# Altium schematic sheet CAN.SchDoc: Title
size A4; Date: *******; ApprovedBy: *******; CheckedBy: None; Author: *******; CompanyName: *******; DrawnBy: Jacob Chisholm; Engineer: *******; Organization: *******; Address1: *******; Address2: *******; Address3: *******; Address4: *******; DocumentNumber: 7; Revision: *******; SheetNumber: 7; SheetTotal: 9; Address_Website: https://jchisholm204.github.io; E-Mail: JacobChisholm1010@gmail.com; CurrentTime: *******; CurrentDate: *******; Time: *******; DocumentFullPathAndName: *******; DocumentName: *******; ModifiedDate: *******; ImagePath: *******; ProjectName: *******; Application_BuildNumber: *******
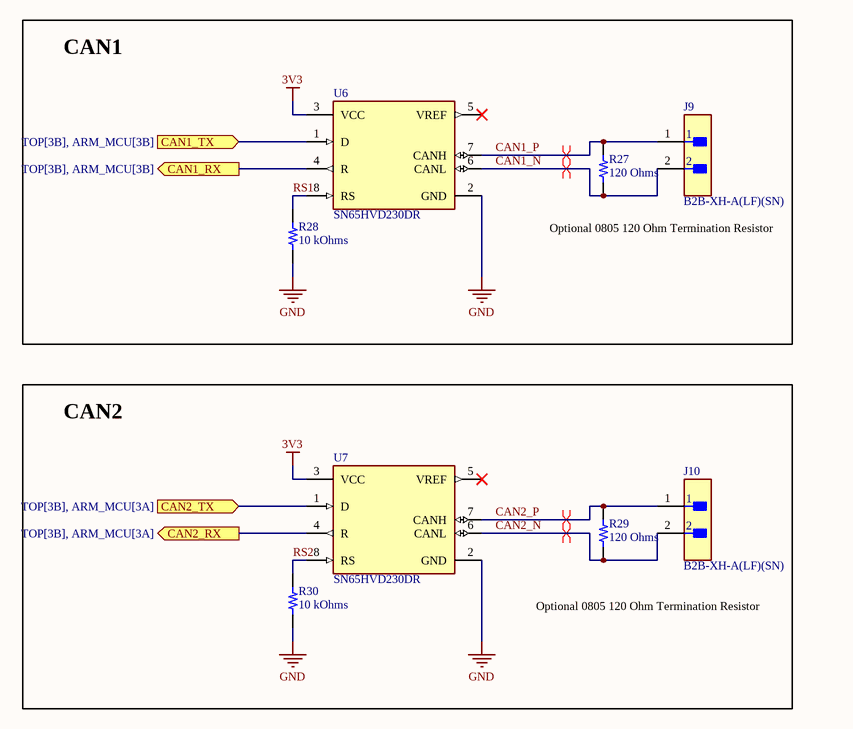
[diagram p0: CAN.SchDoc]

## Parts
J9  B2B-XH-A(LF)(SN)  [FP-B2B-XH-A_LF_SN-MFG]
J10  B2B-XH-A(LF)(SN)  [FP-B2B-XH-A_LF_SN-MFG]
R27  120 Ohms  [RES 0603_1608]
R28  10 kOhms  [RES 0603_1608]
R29  120 Ohms  [RES 0603_1608]
R30  10 kOhms  [RES 0603_1608]
U6  SN65HVD230DR  [FP-D0008A-IPC_A]
U7  SN65HVD230DR  [FP-D0008A-IPC_A]

## Blocks framed on the sheet
CAN1: J9 R27 R28 U6
CAN2: J10 R29 R30 U7

## Ports
CAN1_RX (out, see TOP[3B], ARM_MCU[3B]), CAN1_TX (in, see TOP[3B], ARM_MCU[3B]), CAN2_RX (out, see TOP[3B], ARM_MCU[3A]), CAN2_TX (in, see TOP[3B], ARM_MCU[3A])

## Nets
3V3: U6.3(VCC) U7.3(VCC)
GND: R28.1 R30.1 U6.2(GND) U7.2(GND)
CAN1_N: J9.2 R27.1 U6.6(CANL)
CAN1_P: J9.1 R27.2 U6.7(CANH)
CAN1_RX: U6.4(R) ; port CAN1_RX
CAN1_TX: U6.1(D) ; port CAN1_TX
CAN2_N: J10.2 R29.1 U7.6(CANL)
CAN2_P: J10.1 R29.2 U7.7(CANH)
CAN2_RX: U7.4(R) ; port CAN2_RX
CAN2_TX: U7.1(D) ; port CAN2_TX
RS1: R28.2 U6.8(RS)
RS2: R30.2 U7.8(RS)

Not connected (* = marked no-connect by the designer): U6 5(VREF)*; U7 5(VREF)*

## Layout directives
differential pair: CAN1_N, CAN1_P, CAN2_N, CAN2_P

## Notes on the sheet
- Optional 0805 120 Ohm Termination Resistor
- Title:
- Drawn By:
- Page Contents:
- Checked By:
- Size:
- Date:
- File:
- License:
- Email:
- A4
- Number:
- Time:
- Revision:
- Sheet
- Website:
- of

## Library data of the parts
J9 J10 = CMP-2000-05888-3: CONN HEADER VERT 2POS 2.5MM; Current Rating: 3A; Voltage Rating: 250V; Number of Contacts: 2; Contact Resistance: 20mR; Wire/Cable Gauge: 22AWG; Insulation Resistance: 1GR; Connector Type: Male Pin; Packaging: Bulk; Contact Material: Brass; Lead Free: Lead Free; Orientation: Straight; Contact Plating: Tin; Max Current Rating: 3A; Termination: Solder; Fastening Type: Detent; Depth: 5.75mm; Housing Material: Polyamide; REACH SVHC: No SVHC; Series: XH; Voltage Rating (AC): 250V; Number of Positions: 2; Color: Natural; Contact Type: Male Pin; Max Voltage Rating (DC): 250V; Pitch: 2.5mm; Lead Pitch: 2.5mm; Mount: Through Hole; Max Operating Temperature: 85°C; Length: 7.4mm; Max Voltage Rating (AC): 250V; Min Operating Temperature: -25°C; Number of Rows: 1; Housing Color: White
R27 R29 = TNPU0603120RAYEN00: RES 120 OHM 0.05% 1/10W 0603; Manufacturer: Vishay Dale; Power (Watts): 0.1W, 1/10W; Temperature Coefficient: ±10ppm/°C; Part Number: TNPU0603120RAYEN00; Value: 120 Ohms; ComponentLink1Description: Datasheet; ComponentLink1URL: http://www.vishay.com/docs/28779/tnpue3.pdf; ComponentLink2Description: DigiKey Link; ComponentLink2URL: https://www.digikey.com/en/products/detail/vishay-dale/TNPU0603120RAYEN00/9448838; Composition: Thin Film; Device Package: 0603 (1608 Metric); Features: Anti-Sulfur, Automotive AEC-Q200, Moisture Resistant; Height - Seated (Max): 0.022" (0.55mm); LastUpdated: 2/9/2024 8:43:28 PM; Lifecycle Status: Active; Minimum Order: 1; Number of Terminations: 2; Operating Temperature: -55°C ~ 125°C; Package / Case: 0603 (1608 Metric); Packaging: TapeAndReel; PartId: 7153; Part Status: Active; Price: 0.86; Ratings: AEC-Q200; Resistance: 120 Ohms; Series: TNPU e3; Size / Dimension: 0.063" L x 0.033" W (1.60mm x 0.85mm); Supplier 1: DigiKey; Supplier Part Number 1: 541-4645-1-ND; Supplier Device Package: 0603; Tolerance: ±0.05%
R28 R30 = P2TC0603D1002LNTA: P2TC0603 2PPM/C 10K 0,01% N TA; Manufacturer: Vishay Sfernice; Power (Watts): 0.125W, 1/8W; Temperature Coefficient: ±2ppm/°C; Tolerance: ±0.01%; Part Number: P2TC0603D1002LNTA; Value: 10 kOhms; ComponentLink1Description: Datasheet; ComponentLink1URL: https://www.vishay.com/docs/53080/p2tc.pdf; ComponentLink2Description: DigiKey Link; ComponentLink2URL: https://www.digikey.com/en/products/detail/vishay-sfernice/P2TC0603D1002LNTA/11657673; Composition: Thin Film; Device Package: 0603 (1608 Metric); Features: Anti-Sulfur, Moisture Resistant; Height - Seated (Max): 0.025" (0.63mm); LastUpdated: 2/9/2024 8:41:20 PM; Lifecycle Status: Active; Minimum Order: 1; Number of Terminations: 2; Operating Temperature: -55°C ~ 155°C; Package / Case: 0603 (1608 Metric); Packaging: TapeAndReel; PartId: 62108; Part Status: Active; Price: 11.51; Resistance: 10 kOhms; Series: P2TC; Size / Dimension: 0.060" L x 0.033" W (1.52mm x 0.85mm); Supplier 1: DigiKey; Supplier Part Number 1: 716-P2TC0603D1002LNTACT-ND; Supplier Device Package: 0603
U6 U7 = CMP-0315-00015-3: IC TRANSCEIVER HALF 1/1 8SOIC; Number of Transceivers: 1; Operating Supply Voltage: 3.3V; Number of I/Os: 2; Max Supply Current: 17mA; Max Supply Voltage: 3.6V; Min Supply Voltage: 3V; Data Rate: 1Mbps; Min Operating Temperature: -40°C; Packaging: Tape and Reel; Lead Free: Lead Free; Number of Transmit Buffers: 1; Max Operating Temperature: 85°C; Number of Receive Buffers: 1; Number of Pins: 8; Package Quantity: 1; Radiation Hardening: No; Case/Package: D; REACH SVHC: No SVHC; Weight: 0.002561oz; Termination: SMD/SMT; Contact Plating: Gold; Nominal Supply Current: 17mA; Number of Receivers: 1; Number of Drivers: 1